# Altium schematic sheet 0_Airframe-Overview.SchDoc
size A4; SheetNumber: 1; SheetTotal: 9
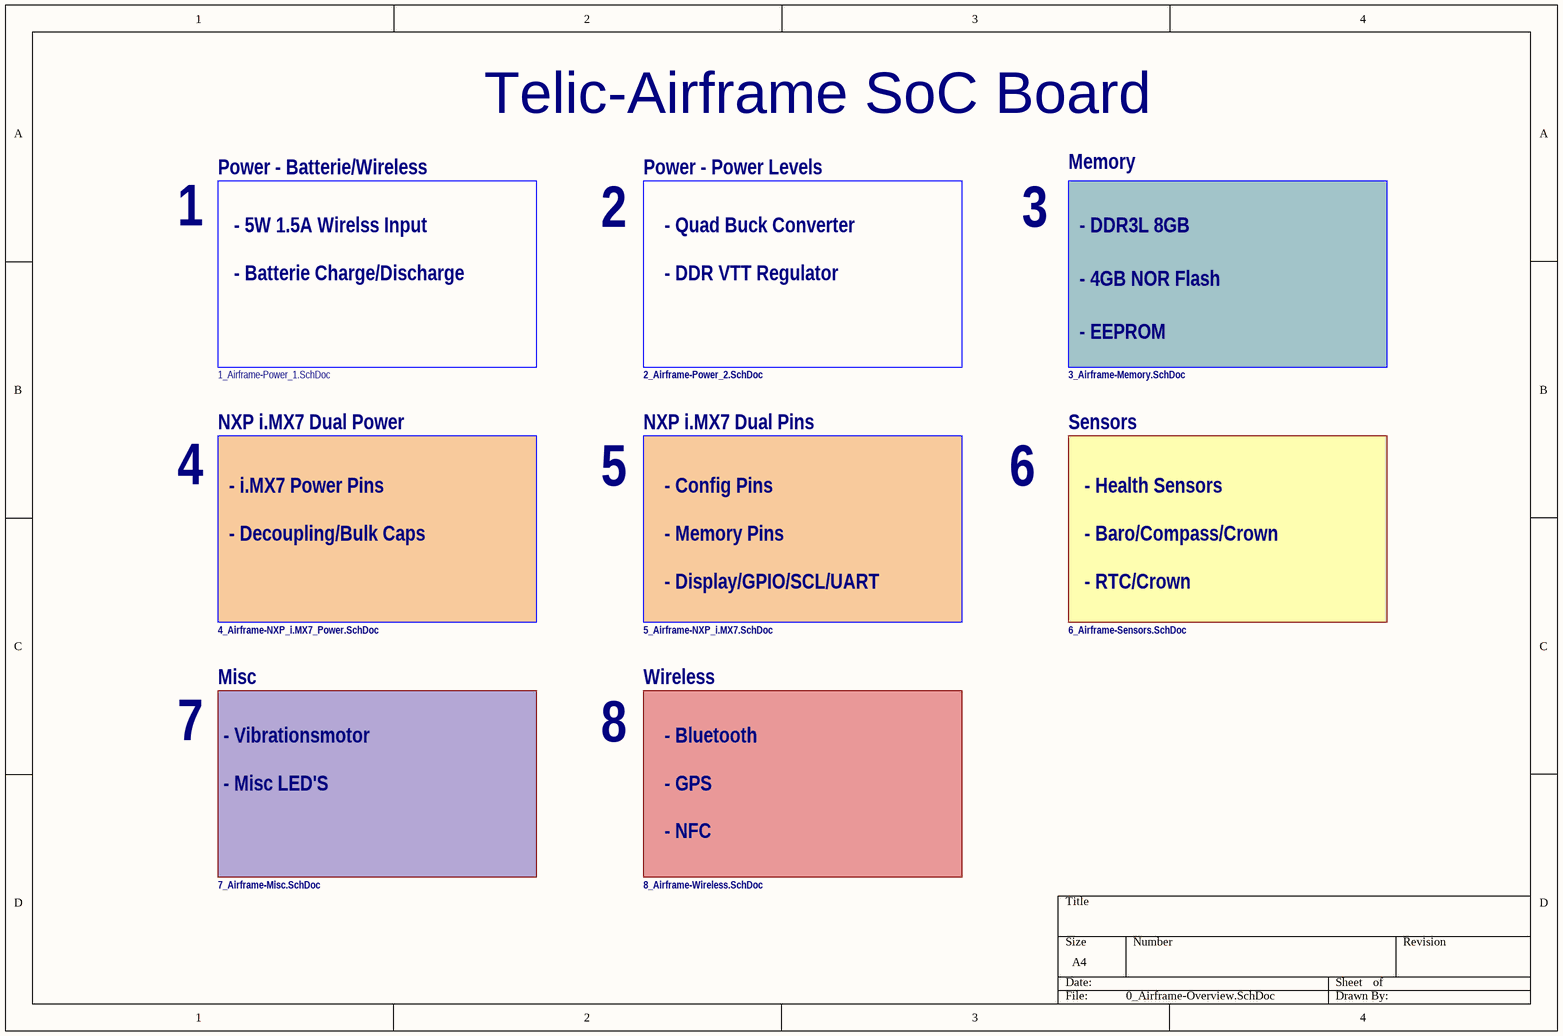
[diagram p0: 0_Airframe-Overview.SchDoc]

## Notes on the sheet
- Power - Batterie/Wireless
- Telic-Airframe SoC Board
- Power - Power Levels
- Memory
- 1
- - 5W 1.5A Wirelss Input
- 2
- - Quad Buck Converter
- 3
- - DDR3L 8GB
- - Batterie Charge/Discharge
- - DDR VTT Regulator
- - 4GB NOR Flash
- 1_Airframe-Power_1.SchDoc
- 2_Airframe-Power_2.SchDoc
- 3_Airframe-Memory.SchDoc
- - EEPROM
- NXP i.MX7 Dual Power
- NXP i.MX7 Dual Pins
- Sensors
- 4
- - i.MX7 Power Pins
- 5
- - Config Pins
- 6
- - Health Sensors
- - Decoupling/Bulk Caps
- - Memory Pins
- - Baro/Compass/Crown
- 4_Airframe-NXP_i.MX7_Power.SchDoc
- 5_Airframe-NXP_i.MX7.SchDoc
- - Display/GPIO/SCL/UART
- 6_Airframe-Sensors.SchDoc
- - RTC/Crown
- Misc
- Wireless
- 7
- - Vibrationsmotor
- 8
- - Bluetooth
- - Misc LED'S
- - GPS
- - NFC
- 7_Airframe-Misc.SchDoc
- 8_Airframe-Wireless.SchDoc